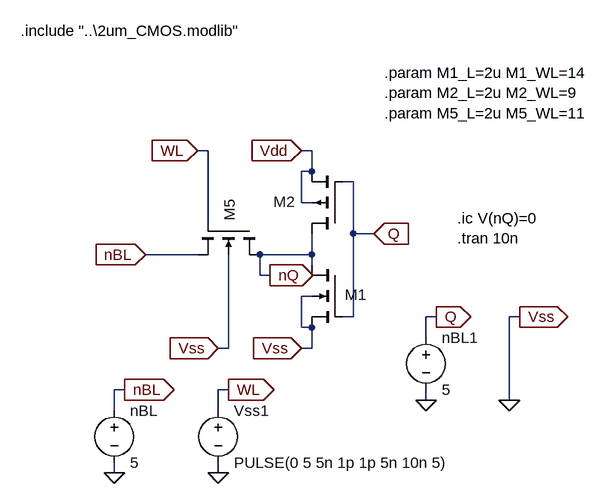
[diagram p0: schematic force_inversion.asc]
force_inversion.asc, the LTspice schematic file:
Version 4
SHEET 1 1180 1172
WIRE -560 112 -576 112
WIRE -400 112 -416 112
WIRE -400 144 -400 112
WIRE -400 144 -416 144
WIRE -336 160 -352 160
WIRE -416 192 -416 144
WIRE -400 192 -416 192
WIRE -560 224 -560 112
WIRE -336 240 -336 160
WIRE -304 240 -336 240
WIRE -576 272 -656 272
WIRE -400 272 -400 240
WIRE -400 272 -480 272
WIRE -400 288 -400 272
WIRE -480 304 -480 272
WIRE -464 304 -480 304
WIRE -400 336 -416 336
WIRE -336 368 -336 240
WIRE -336 368 -352 368
WIRE -208 368 -224 368
WIRE -80 368 -96 368
WIRE -416 384 -416 336
WIRE -400 384 -416 384
WIRE -224 400 -224 368
WIRE -528 416 -528 272
WIRE -528 416 -544 416
WIRE -400 416 -400 384
WIRE -400 416 -416 416
WIRE -688 480 -704 480
WIRE -528 480 -544 480
WIRE -224 496 -224 480
WIRE -96 496 -96 368
WIRE -704 512 -704 480
WIRE -544 512 -544 480
WIRE -704 608 -704 592
WIRE -544 608 -544 592
FLAG -416 416 Vss
IOPIN -416 416 In
FLAG -656 272 nBL
IOPIN -656 272 In
FLAG -576 112 WL
IOPIN -576 112 In
FLAG -416 112 Vdd
IOPIN -416 112 In
FLAG -464 304 nQ
IOPIN -464 304 Out
FLAG -304 240 Q
IOPIN -304 240 In
FLAG -688 480 nBL
IOPIN -688 480 Out
FLAG -544 416 Vss
IOPIN -544 416 In
FLAG -208 368 Q
IOPIN -208 368 Out
FLAG -80 368 Vss
IOPIN -80 368 Out
FLAG -96 496 0
FLAG -528 480 WL
IOPIN -528 480 Out
FLAG -224 496 0
FLAG -544 608 0
FLAG -704 608 0
SYMBOL pmos4 -352 240 R180
WINDOW 0 73 49 Left 2
WINDOW 3 55 45 Invisible 2
SYMATTR InstName M2
SYMATTR Value P_2u
SYMATTR Value2 l={M2_L} w={M2_L * M2_WL}
SYMBOL nmos4 -352 288 M0
WINDOW 0 -37 46 Left 2
WINDOW 3 -70 42 Invisible 2
SYMATTR InstName M1
SYMATTR Value N_2u
SYMATTR Value2 l={M1_L} w={M1_L * M1_WL}
SYMBOL nmos4 -480 224 R90
WINDOW 0 -37 46 Left 2
WINDOW 3 -70 42 Invisible 2
SYMATTR InstName M5
SYMATTR Value N_2u
SYMATTR Value2 l={M5_L} w={M5_L * M5_WL}
SYMBOL voltage -704 496 R0
SYMATTR InstName nBL
SYMATTR Value 5
SYMBOL voltage -224 384 R0
SYMATTR InstName nBL1
SYMATTR Value 5
SYMBOL voltage -544 496 R0
SYMATTR InstName Vss1
SYMATTR Value PULSE(0 5 5n 1p 1p 5n 10n 5)
TEXT -848 -72 Left 2 !.include "..\\2um_CMOS.modlib"
TEXT -288 -8 Left 2 !.param M1_L=2u M1_WL=14\n.param M2_L=2u M2_WL=9\n.param M5_L=2u M5_WL=11
TEXT -176 216 Left 2 !.ic V(nQ)=0\n.tran 10n

The netlist it stands for:
* force_inversion.asc
M2 nQ Q Vdd Vdd P_2u l={M2_L} w={M2_L * M2_WL}
M1 nQ Q 0 0 N_2u l={M1_L} w={M1_L * M1_WL}
M5 nQ WL nBL 0 N_2u l={M5_L} w={M5_L * M5_WL}
V§nBL nBL 0 5
V§nBL1 Q 0 5
Vss1 WL 0 PULSE(0 5 5n 1p 1p 5n 10n 5)
.model NMOS NMOS
.model PMOS PMOS
.lib standard.mos
.include "..\2um_CMOS.modlib"
.param M1_L=2u M1_WL=14
.param M2_L=2u M2_WL=9
.param M5_L=2u M5_WL=11
.ic V(nQ)=0
.tran 10n
.backanno
.end